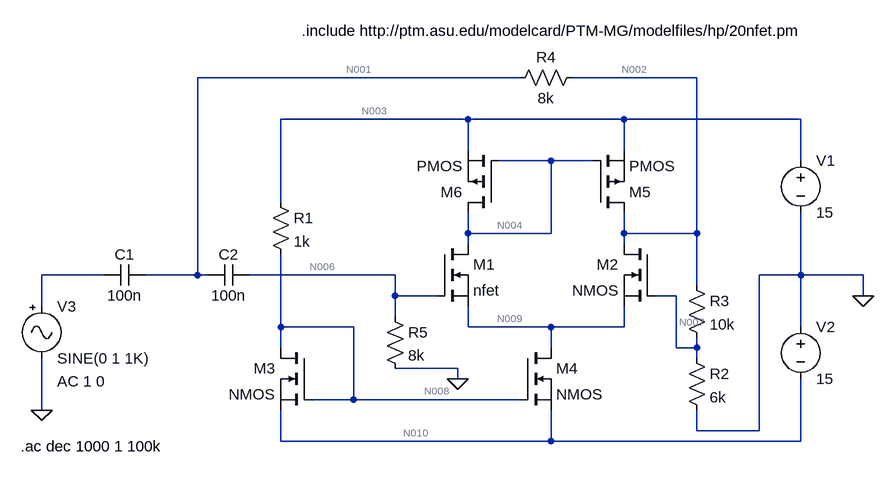
[diagram p0: schematic chegg_opamp.asc]
chegg_opamp.asc, the LTspice schematic file:
Version 4
SHEET 1 884 680
WIRE 304 -80 -192 -80
WIRE 576 -80 384 -80
WIRE 224 -16 -64 -16
WIRE 464 -16 224 -16
WIRE 736 -16 464 -16
WIRE 224 32 224 -16
WIRE 464 32 464 -16
WIRE 352 48 272 48
WIRE 416 48 352 48
WIRE 736 48 736 -16
WIRE -64 112 -64 -16
WIRE 224 160 224 128
WIRE 352 160 352 48
WIRE 352 160 224 160
WIRE 464 160 464 128
WIRE 576 160 576 -80
WIRE 576 160 464 160
WIRE 224 176 224 160
WIRE 464 176 464 160
WIRE -336 224 -432 224
WIRE -192 224 -192 -80
WIRE -192 224 -272 224
WIRE -176 224 -192 224
WIRE 112 224 -112 224
WIRE 736 224 736 128
WIRE 736 224 672 224
WIRE 832 224 736 224
WIRE 576 240 576 160
WIRE 112 256 112 224
WIRE 176 256 112 256
WIRE 544 256 512 256
WIRE 832 256 832 224
WIRE -432 272 -432 224
WIRE 112 288 112 256
WIRE -64 304 -64 192
WIRE 48 304 -64 304
WIRE 224 304 224 272
WIRE 352 304 224 304
WIRE 464 304 464 272
WIRE 464 304 352 304
WIRE 736 304 736 224
WIRE -64 336 -64 304
WIRE 352 336 352 304
WIRE 544 336 544 256
WIRE 576 336 576 320
WIRE 576 336 544 336
WIRE 576 352 576 336
WIRE 208 368 112 368
WIRE 208 384 208 368
WIRE 48 416 48 304
WIRE 48 416 -16 416
WIRE 304 416 48 416
WIRE -432 432 -432 352
WIRE 576 464 576 432
WIRE 672 464 672 224
WIRE 672 464 576 464
WIRE -64 480 -64 432
WIRE 352 480 352 432
WIRE 352 480 -64 480
WIRE 736 480 736 384
WIRE 736 480 352 480
FLAG 832 256 0
FLAG 208 384 0
FLAG -432 432 0
SYMBOL nmos 176 176 R0
SYMATTR InstName M1
SYMATTR Value nfet
SYMBOL nmos 512 176 M0
SYMATTR InstName M2
SYMBOL nmos -16 336 M0
SYMATTR InstName M3
SYMBOL nmos 304 336 R0
SYMATTR InstName M4
SYMBOL res -80 96 R0
SYMATTR InstName R1
SYMATTR Value 1k
SYMBOL pmos 416 128 M180
SYMATTR InstName M5
SYMBOL pmos 272 128 R180
SYMATTR InstName M6
SYMBOL voltage 736 32 R0
WINDOW 123 0 0 Left 0
WINDOW 39 0 0 Left 0
SYMATTR InstName V1
SYMATTR Value 15
SYMBOL res 560 336 R0
SYMATTR InstName R2
SYMATTR Value 6k
SYMBOL res 560 224 R0
SYMATTR InstName R3
SYMATTR Value 10k
SYMBOL res 400 -96 R90
WINDOW 0 0 56 VBottom 2
WINDOW 3 32 56 VTop 2
SYMATTR InstName R4
SYMATTR Value 8k
SYMBOL res 96 272 R0
SYMATTR InstName R5
SYMATTR Value 8k
SYMBOL cap -272 208 R90
WINDOW 0 0 32 VBottom 2
WINDOW 3 32 32 VTop 2
SYMATTR InstName C1
SYMATTR Value 100n
SYMBOL cap -112 208 R90
WINDOW 0 0 32 VBottom 2
WINDOW 3 32 32 VTop 2
SYMATTR InstName C2
SYMATTR Value 100n
SYMBOL Misc\\signal -432 256 R0
WINDOW 123 24 132 Left 2
WINDOW 39 0 0 Left 0
SYMATTR Value2 AC 1 0
SYMATTR InstName V3
SYMBOL voltage 736 288 R0
WINDOW 123 0 0 Left 0
WINDOW 39 0 0 Left 0
SYMATTR InstName V2
SYMATTR Value 15
TEXT -464 488 Left 2 !.ac dec 1000 1 100k
TEXT -32 -152 Left 2 !.include http://ptm.asu.edu/modelcard/PTM-MG/modelfiles/hp/20nfet.pm

The netlist it stands for:
* chegg_opamp.asc
M1 N004 N006 N009 N009 nfet
M2 N002 N007 N009 N009 NMOS
M3 N008 N008 N010 N010 NMOS
M4 N009 N008 N010 N010 NMOS
R1 N003 N008 1k
M5 N002 N004 N003 N003 PMOS
M6 N004 N004 N003 N003 PMOS
V1 N003 0 15
R2 N007 0 6k
R3 N002 N007 10k
R4 N002 N001 8k
R5 N006 0 8k
C1 N001 N005 100n
C2 N006 N001 100n
V3 N005 0 SINE(0 1 1K) AC 1 0
V2 0 N010 15
.model NMOS NMOS
.model PMOS PMOS
.lib standard.mos
.ac dec 1000 1 100k
.include http://ptm.asu.edu/modelcard/PTM-MG/modelfiles/hp/20nfet.pm
.backanno
.end

* Results of the author's LTspice run, read from the files saved beside the schematic
* Operating Point, zero values left out:
*   V(n004) = 4.79 V
*   V(n009) = -10.21 V
*   V(n002) = 137.7 nV
*   V(n007) = 51.66 nV
*   V(n008) = 9.162 V
*   V(n010) = -15 V
*   V(n003) = 15 V
*   V(n001) = 137.7 nV
*   Id(M6) = -1.043 mA
*   Ib(M6) = 10.22 pA
*   Is(M6) = 1.043 mA
*   Id(M5) = -1.043 mA
*   Ib(M5) = 15.01 pA
*   Is(M5) = 1.043 mA
*   Id(M4) = 2.085 mA
*   Ib(M4) = -4.8 pA
*   Is(M4) = -2.085 mA
*   Id(M3) = 5.838 mA
*   Ib(M3) = -24.17 pA
*   Is(M3) = -5.838 mA
*   Id(M2) = 1.043 mA
*   Ib(M2) = -10.22 pA
*   Is(M2) = -1.043 mA
*   Id(M1) = 1.043 mA
*   Ib(M1) = -15.01 pA
*   Is(M1) = -1.043 mA
*   I(R3) = 8.609 pA
*   I(R2) = 8.609 pA
*   I(R1) = 5.838 mA
*   I(V2) = -7.923 mA
*   I(V1) = -7.923 mA
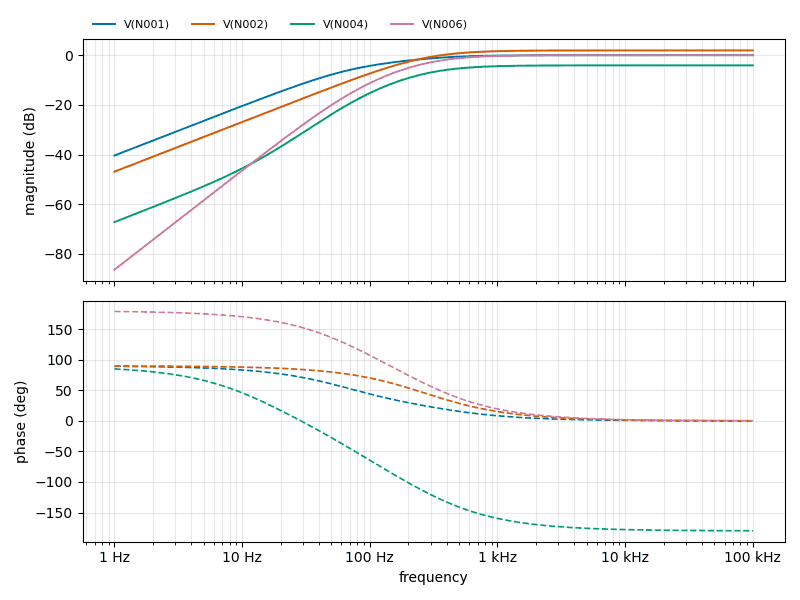
[diagram p1: AC Analysis of chegg_opamp.asc, plotted from the saved traces]
* AC Analysis, 1 run:
*   V(N001): -40.41 dB at 1 Hz, -0.00 dB at 100 kHz, peak -0.00 dB at 100 kHz, 3 dB below the peak at 145.8 Hz
*   V(N002): -46.90 dB at 1 Hz, 1.91 dB at 100 kHz, peak 1.91 dB at 100 kHz, 3 dB below the peak at 272.8 Hz
*   V(N004): -67.22 dB at 1 Hz, -4.10 dB at 100 kHz, peak -4.10 dB at 100 kHz, 3 dB below the peak at 291 Hz
*   V(N006): -86.38 dB at 1 Hz, -0.00 dB at 100 kHz, peak -0.00 dB at 100 kHz, 3 dB below the peak at 291.7 Hz